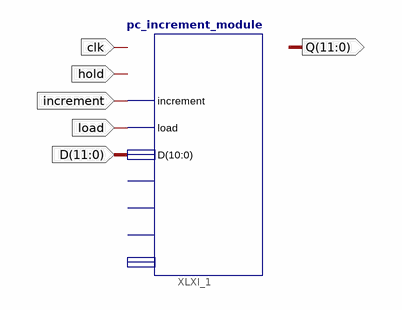
[diagram p0: schematic sheet 1]
// Xilinx ISE schematic test_increment_module.sch (artix7) as structural Verilog: 1 symbols, 6 ports
module test_increment_module (
  input  clk,
  input  hold,
  input  increment,
  input  load,
  input  [11:0] D,
  output [11:0] Q
);

  pc_increment_module XLXI_1 (.increment(increment), .load(load), .D(D));  // open: is_BSR, is_RET, S, stack_in
endmodule
